# Altium schematic sheet Sheet1.SchDoc
size A3
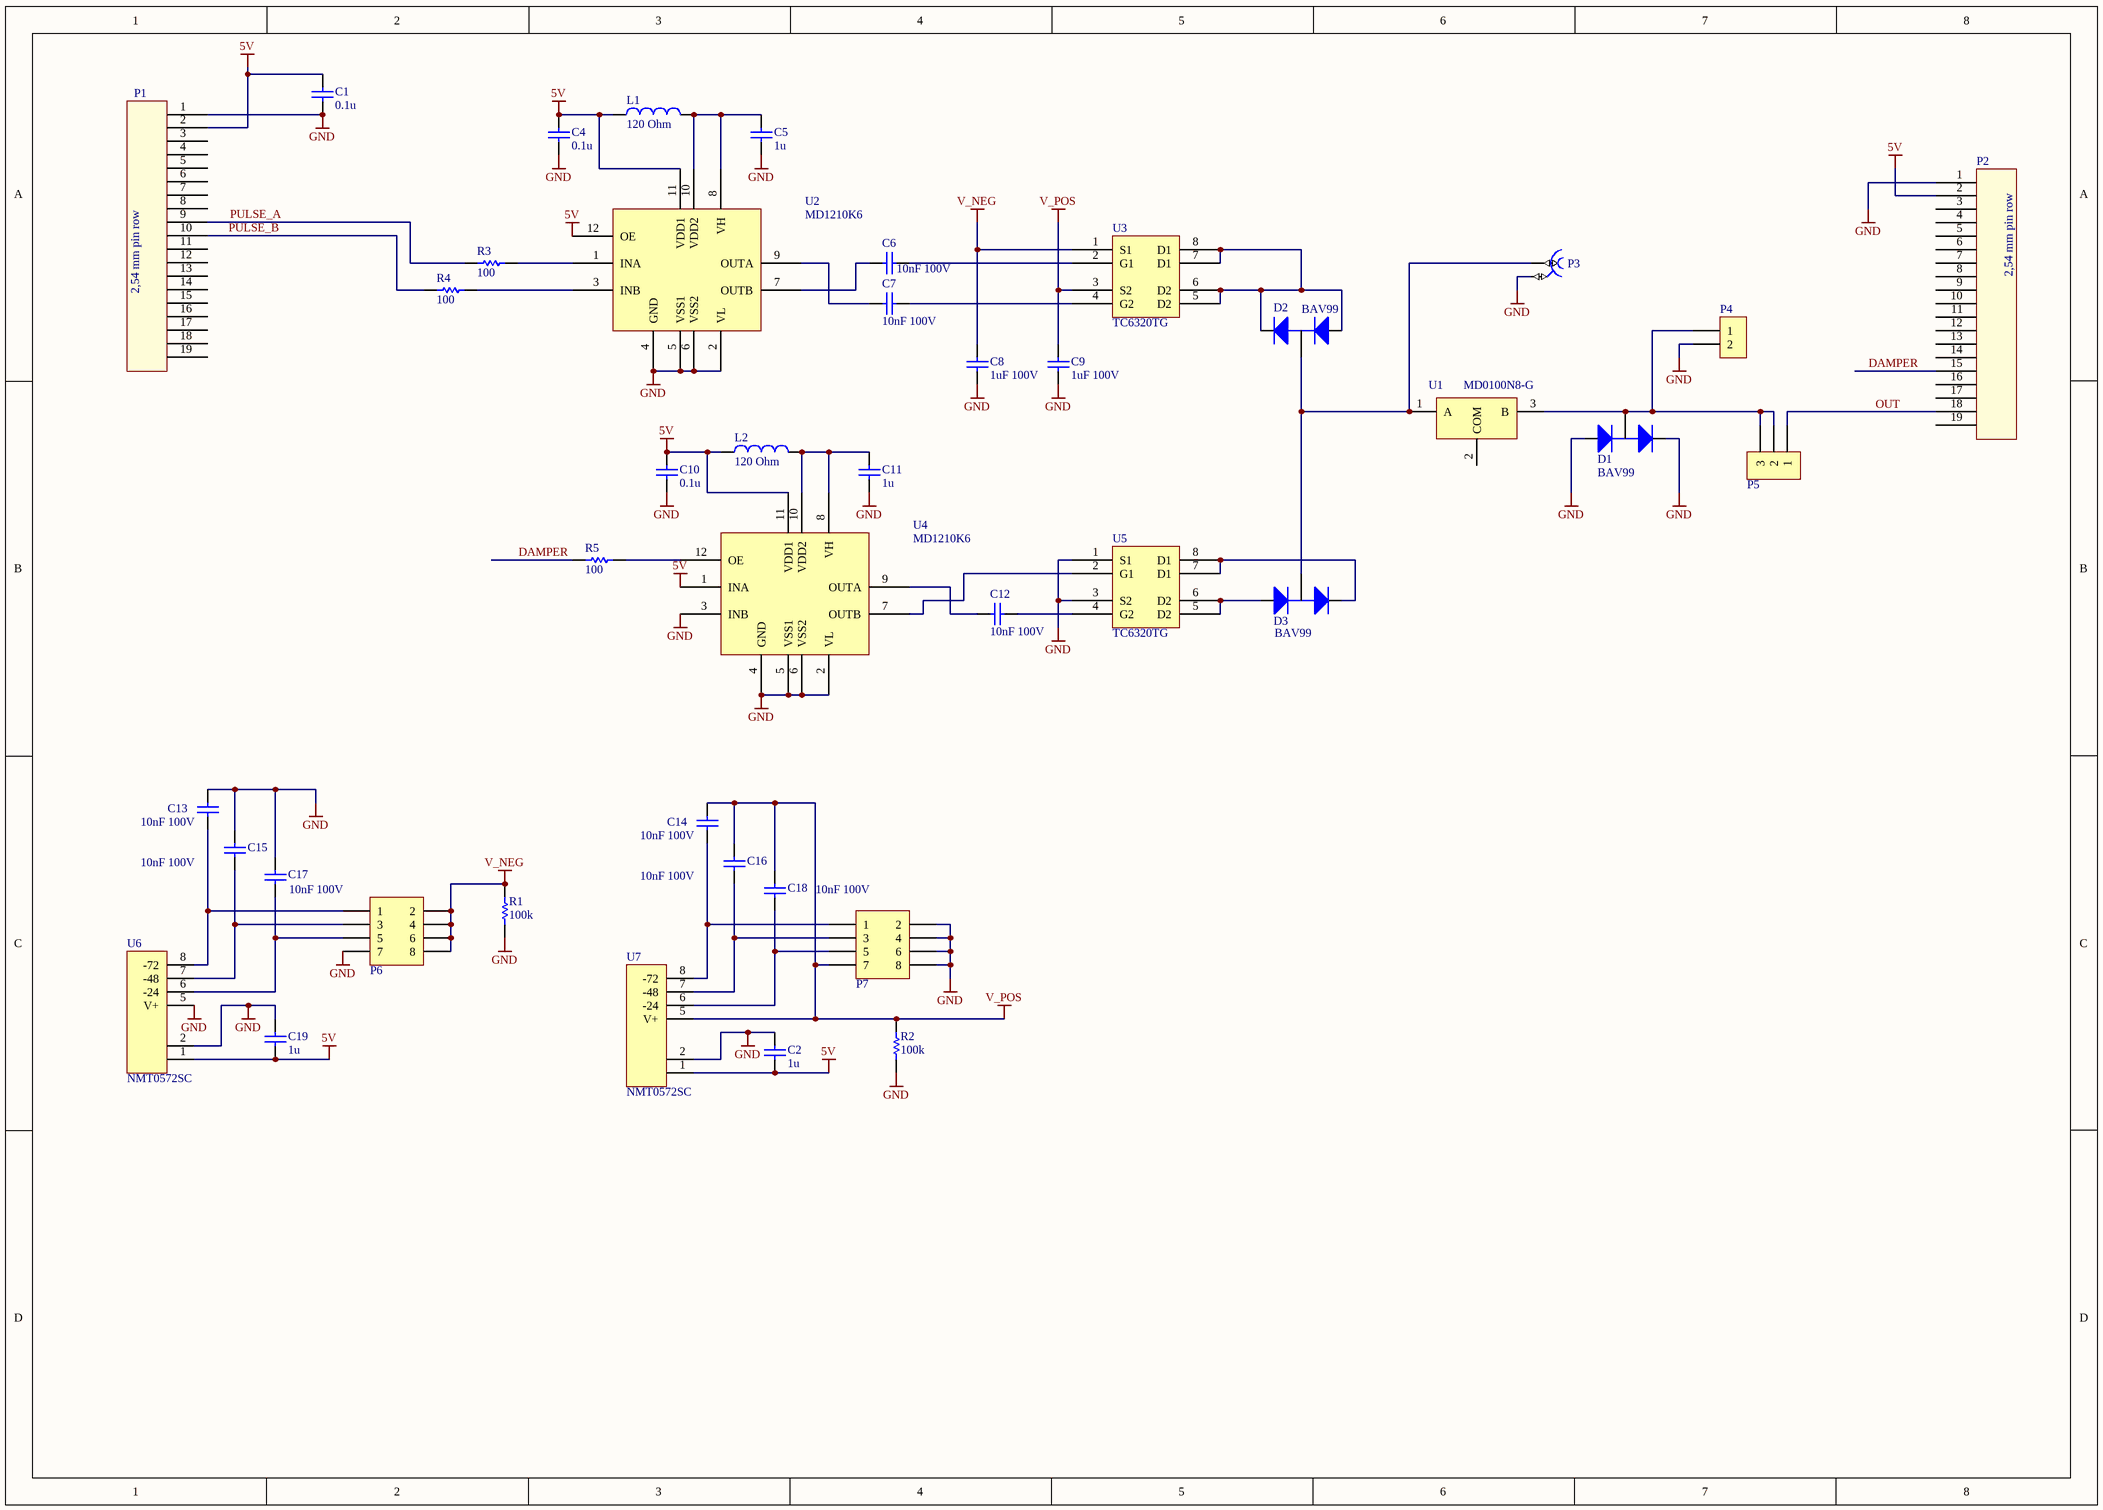
[diagram p0: Sheet1.SchDoc]

## Parts
C1  0.1u  [0603RC]
C2  1u  [0805RC]
C4  0.1u  [0603RC]
C5  1u  [0805RC]
C6  10nF 100V  [0805RC]
C7  10nF 100V  [0805RC]
C8  1uF 100V  [1206RC]
C9  1uF 100V  [1206RC]
C10  0.1u  [0603RC]
C11  1u  [0805RC]
C12  10nF 100V  [0805RC]
C13  10nF 100V  [0805RC]
C14  10nF 100V  [0805RC]
C15  10nF 100V  [0805RC]
C16  10nF 100V  [0805RC]
C17  10nF 100V  [0805RC]
C18  10nF 100V  [0805RC]
C19  1u  [0805RC]
D1  BAV99  [SOT-23]
D2  BAV99  [SOT-23]
D3  BAV99  [SOT-23]
L1  value 120 Ohm  [0805R]  (hidden comment: BLM21PG121SN1D)
L2  value 120 Ohm  [0805R]  (hidden comment: BLM21PG121SN1D)
P1  PLS_2.54mm-19  [PLS_2.54mm-19]  (value not drawn)
P2  PLS_2.54mm-19  [PLS_2.54mm-19]  (value not drawn)
P3  SMA  [AMPHENOL_132357-11]  (value not drawn)
P4  SCSL-2  [SCSL-2]  (value not drawn)
P5  PLS-3  [PLS-3]  (value not drawn)
P6  PLD-8  [PLD-8]  (value not drawn)
P7  PLD-8  [PLD-8]  (value not drawn)
R1  100k  [0805R]
R2  100k  [0805R]
R3  100  [0603R]
R4  100  [0603R]
R5  100  [0603R]
U1  MD0100N8-G  [SOT89]
U2  MD1210K6  [QFN-12 4x4mm]
U3  TC6320TG  [SOIC127P600-8N]
U4  MD1210K6  [QFN-12 4x4mm]
U5  TC6320TG  [SOIC127P600-8N]
U6  NMT0572SC  [NMT0572SC]
U7  NMT0572SC  [NMT0572SC]

## Nets
5V: C1.2 C2.1 C4.2 C10.2 C19.1 L1.1 L2.1 P1.2 P2.2 U2.11(VDD1) U2.12(OE) U4.1(INA) U4.11(VDD1) U6.1 U7.1
GND: C1.1 C2.2 C4.1 C5.1 C8.1 C9.1 C10.1 C11.1 C13.1 C15.1 C17.1 C19.2 D1.1(A) D1.2(K) P1.1 P2.1 P3.2 P4.2 P6.7 P7.2 P7.4 P7.6 P7.8 R1.1 R2.1 U2.2(VL) U2.4(GND) U2.5(VSS1) U2.6(VSS2) U4.2(VL) U4.3(INB) U4.4(GND) U4.5(VSS1) U4.6(VSS2) U5.1(S1) U5.3(S2) U6.2 U6.5(V+) U7.2
V_NEG: C8.2 P6.2 P6.4 P6.6 P6.8 R1.2 U3.1(S1)
V_POS: C9.2 C14.1 C16.1 C18.1 P7.7 R2.2 U3.3(S2) U7.5(V+)
DAMPER: P2.15 R5.1
PULSE_A: P1.9 R3.1
PULSE_B: P1.10 R4.1
NetC5_2: C5.2 L1.2 U2.8(VH) U2.10(VDD2)
NetC6_1: C6.1 U3.2(G1)
NetC6_2: C6.2 U2.7(OUTB)
NetC7_1: C7.1 U3.4(G2)
NetC7_2: C7.2 U2.9(OUTA)
NetC11_2: C11.2 L2.2 U4.8(VH) U4.10(VDD2)
NetC12_1: C12.1 U5.4(G2)
NetC12_2: C12.2 U4.9(OUTA)
NetC13_2: C13.2 P6.1 U6.8(-72)
NetC14_2: C14.2 P7.1 U7.8(-72)
NetC15_2: C15.2 P6.3 U6.7(-48)
NetC16_2: C16.2 P7.3 U7.7(-48)
NetC17_2: C17.2 P6.5 U6.6(-24)
NetC18_2: C18.2 P7.5 U7.6(-24)
NetD1_3: D1.3(C) P4.1 P5.2 P5.3 U1.3(B)
NetD2_1: D2.1(A) D2.2(K) U3.5(D2) U3.6(D2) U3.7(D1) U3.8(D1)
NetD2_3: D2.3(C) D3.3(C) P3.1 U1.1(A)
NetD3_1: D3.1(A) U5.5(D2) U5.6(D2)
NetD3_2: D3.2(K) U5.7(D1) U5.8(D1)
NetP2_18: P2.18 P5.1
NetR3_2: R3.2 U2.1(INA)
NetR4_2: R4.2 U2.3(INB)
NetR5_2: R5.2 U4.12(OE)
NetU4_7: U4.7(OUTB) U5.2(G1)

Not connected (* = marked no-connect by the designer): P1 3 4 5 6 7 8 11 12 13 14 15 16 17 18 19; P2 3 4 5 6 7 8 9 10 11 12 13 14 16 17 19; U1 2(COM); U6 3 4; U7 3 4

## Notes on the sheet
- Labels drawn without touching a wire or pin: OUT
- (in symbol PLS_2.54mm-19) 2,54 mm pin row

## Library data of the parts
C1 C2 C4-C19 = Cap: Capacitor; Published: 8-Jun-2000; LatestRevisionDate: 17-Jul-2002; LatestRevisionNote: Re-released for DXP Platform.; PackageReference: RAD-0.3; Publisher: Altium Limited
  C1 C4 C10: Value: 0.1u
  C2 C5 C11 C19: Value: 1u
  C6 C7 C12-C18: Value: 10nF 100V
  C8 C9: Value: 1uF 100V
D1-D3 = BAV199: Medium-speed Switching Double Diode with Low Leakage Current; Published: 17-Sep-2003; LatestRevisionDate: 12-Dec-2006; LatestRevisionNote: IPC-7351 Footprint Added.; DatasheetVersion: 12-Oct-2001; PackageVersion: May-1999; PackageReference: SOT23; Publisher: Altium Limited; PackageDescription: 3-Pin SOT-23 Package 0.95 mm Pitch, 2.3 mm Lead Span; ComponentLink1Description: Manufacturer Link; ComponentLink1URL: http://www.semiconductors.philips.com/; ComponentLink2Description: Datasheet; ComponentLink2URL: http://www.semiconductors.philips.com/acrobat/datasheets/BAV199_4.pdf
L1 L2 = Inductor: Code_IEC: 1005; Published: 8-Jun-2000; LatestRevisionDate: 29-May-2009; LatestRevisionNote: IPC-7351 Footprint Added.; PackageReference: 0402-A; Publisher: Altium Limited; PackageDescription: Chip Inductor; Code_JEITA: 0402
P3 = AMPHENOL_132357-11: Part Description: SMA End Launch Jack for 1.58mm PCB, 50 Ohm, Flat Tab Contact; Part Number: AMPHENOL_132357-11; Component Kind: Standard; Component Type: Standard; Pin Count: 2; Family: SMA; Mounted: Yes; Socket: No; SMD: Yes; Status: None; Manufacturer: AMPHENOL; Manufacturer Part Number: 132357-11; ComponentHeight: 7.92mm; HelpURL: \\cern.ch\dfs\Applications\Altium\Datasheets\AMPHENOL_132357-11.pdf; Author: CERN DEM JLC; CreateDate: 5/14/2012; LatestRevisionDate: 5/14/2012; Table: AMPHENOL
P4 = Header 2: 2-pin general header; LatestRevisionDate: 17-Jul-2002; LatestRevisionNote: Re-released for DXP Platform.; Publisher: Altium Limited
P5 = Header 3: 3-pin general header; LatestRevisionDate: 17-Jul-2002; LatestRevisionNote: Re-released for DXP Platform.; Publisher: Altium Limited
P6 P7 = Header 4X2: Header, 4-Pin, Dual row; LatestRevisionDate: 17-Jul-2002; LatestRevisionNote: Re-released for DXP Platform.; Publisher: Altium Limited
R1-R5 = Res1: Resistor; Published: 8-Jun-2000; LatestRevisionDate: 17-Jul-2002; LatestRevisionNote: Re-released for DXP Platform.; PackageReference: AXIAL-0.3; Publisher: Altium Limited
  R1 R2: Value: 100k
  R3-R5: Value: 100
U1 = MD0100N8-G: 3-Ultra-Sound HV Switch 1=A 2=COM 3=B; Manufacturer: Supertex inc.; Table: Analog & Interface; Part Number: MD0100N8-G; Component Kind: Standard; Component Type: Standard; Device: MD0100N8-G; PackageDescription: SOT89-3, 3-Leads, Body 2.44x4.5mm; Part Description: Ultra-Sound HV Switch; Manufacturer Part Number: MD0100N8-G; Pin Count: 4; Case: SOT89; Mounted: Yes; Socket: No; SMD: Yes; ComponentHeight: 1.6mm; Author: S. Jafar; CreateDate: 12/20/2015; LatestRevisionDate: 1/6/2016
U2 U4 = MD1210
U3 U5 = TC6320: N- and P-Channel  Enhancement-Mode MOSFET Pair
U6 U7 = Header 8: Horizontal; LatestRevisionDate: 17-Jul-2002; LatestRevisionNote: Re-released for DXP Platform.; Publisher: Altium Limited